# EasyEDA Pro project ProPrj_nigeria__2025-12-29.epro, board PCB1
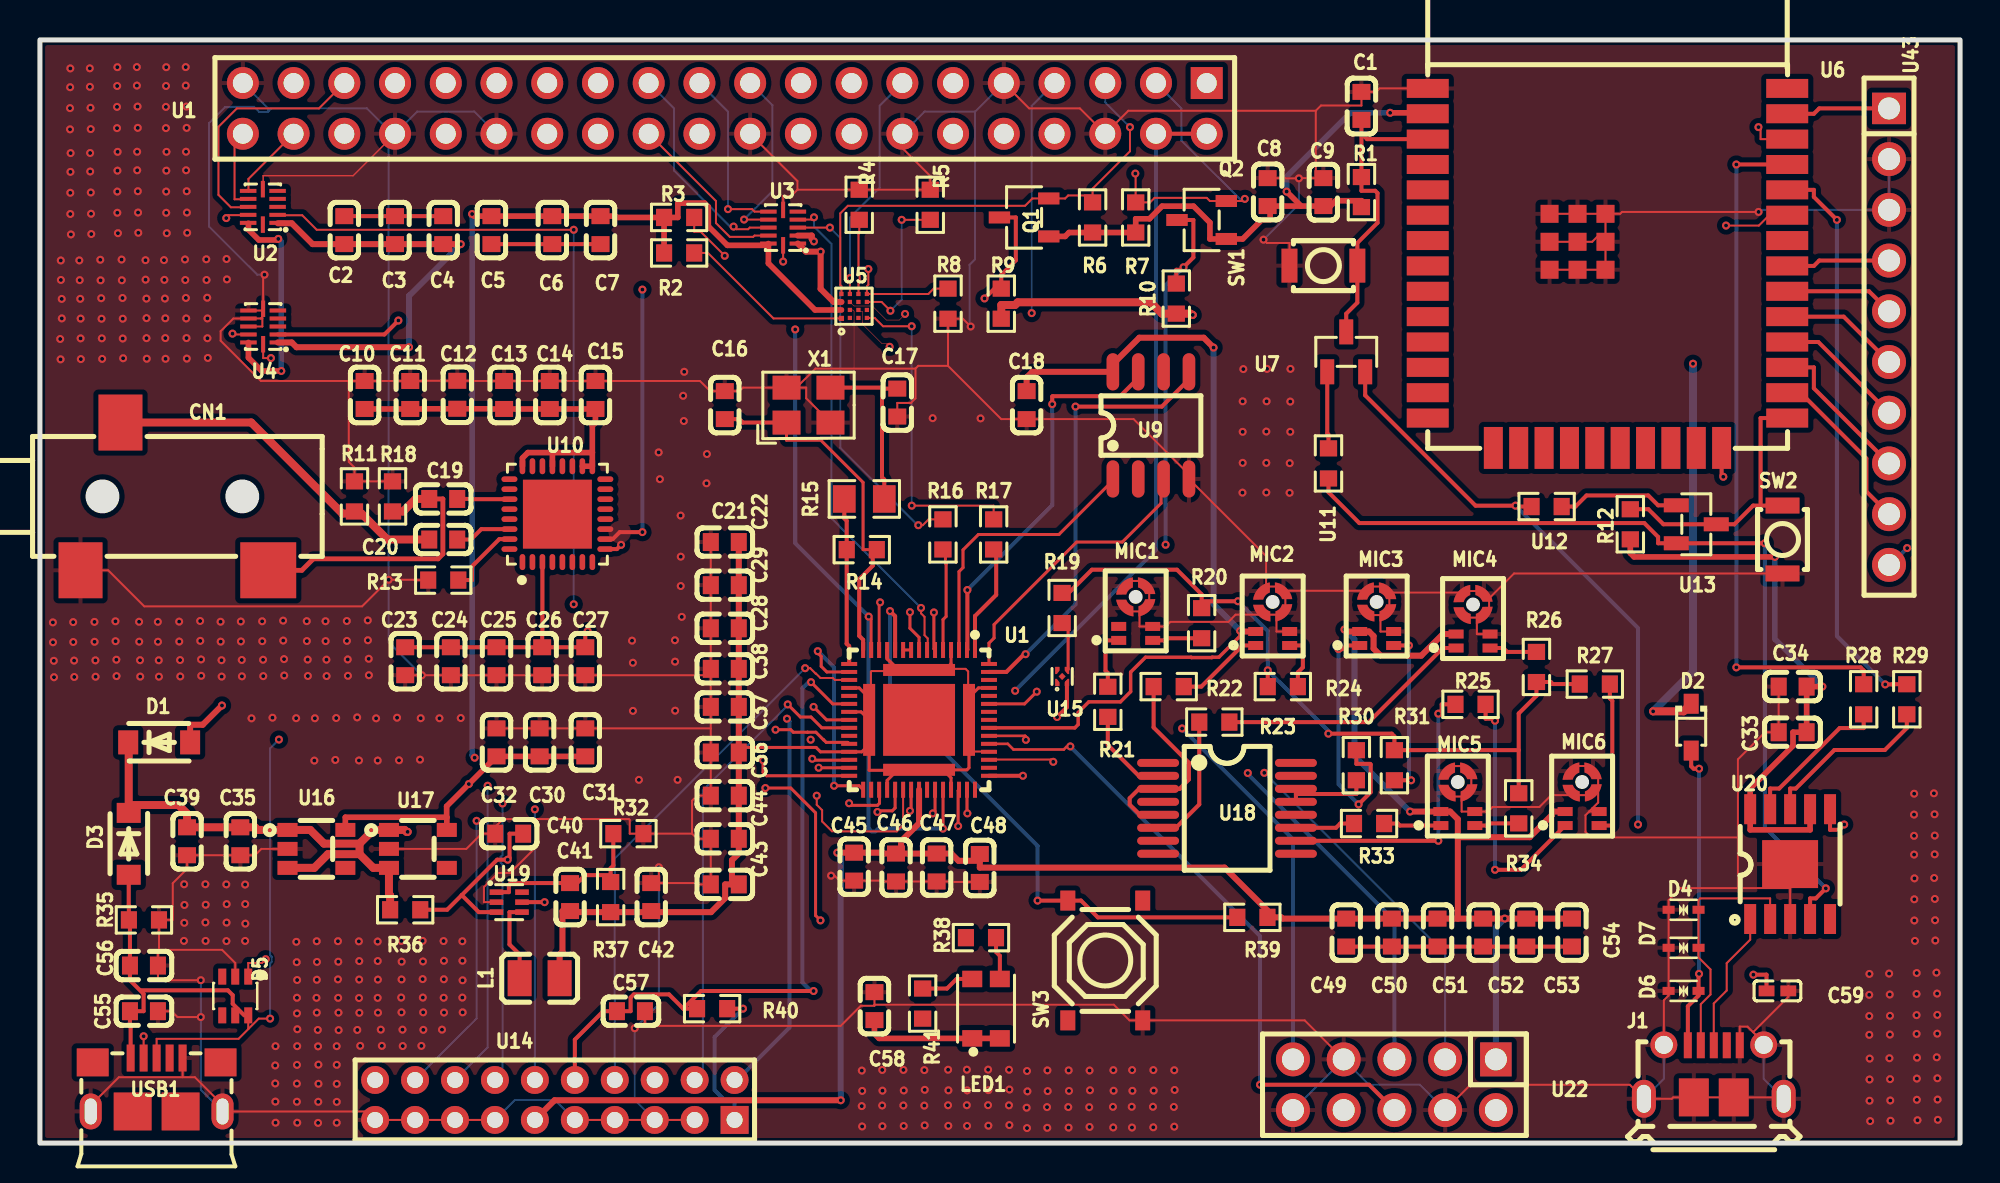
[diagram p7: board, top side]
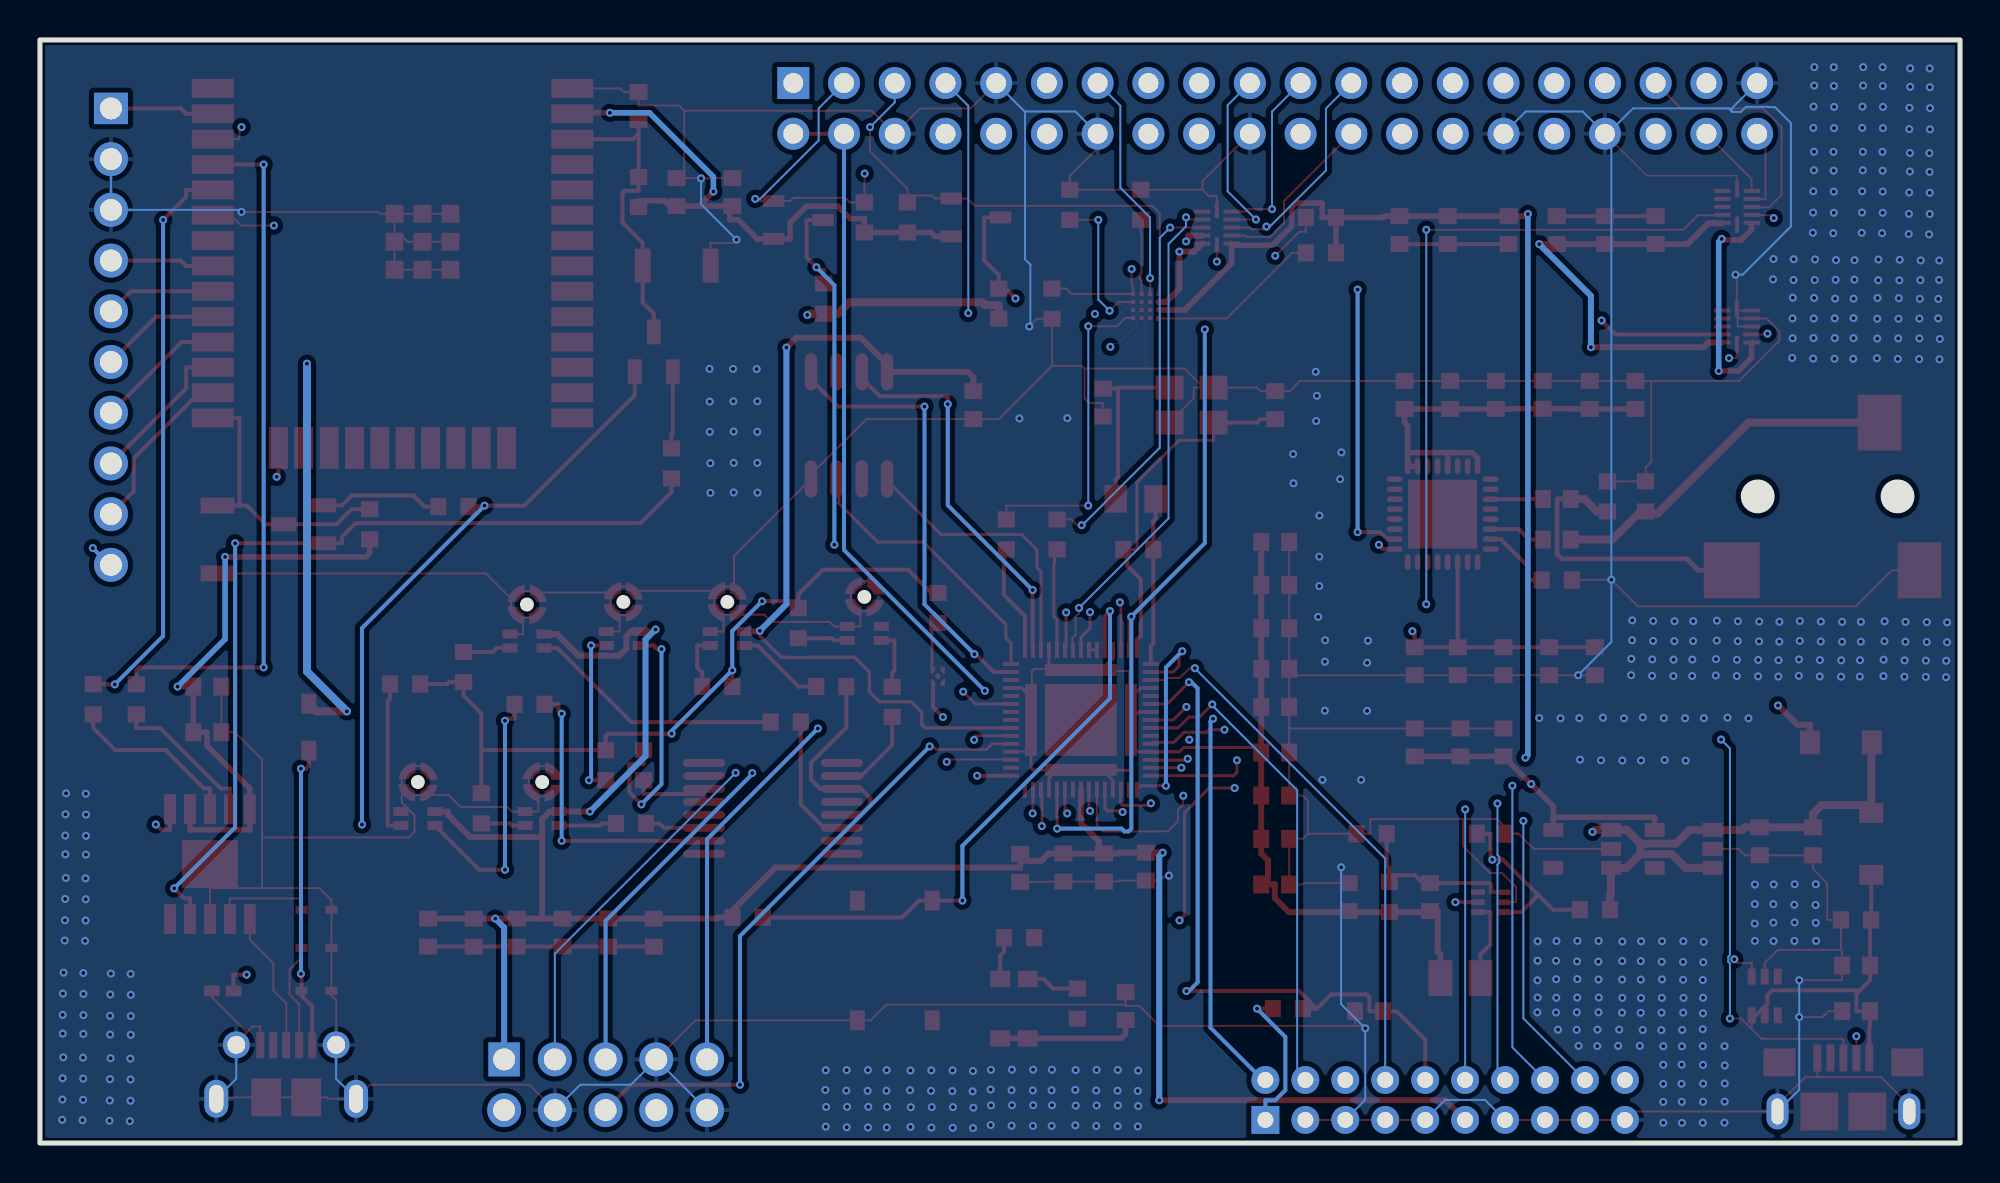
[diagram p8: board, bottom side, seen from below]

Outline 96.14 x 55.24 mm; copper layers: Top Layer, Inner1, Inner2, Bottom Layer. Coordinates in mm from the lower left corner of the outline.
Outline path: rectangle 0,55.24 96.14,0
Stack: Top Layer 0.035mm Outer layer thickness 1oz / Dielectric1 0.2104mm 7628 RC49% 8.6mil / Inner1 0.0152mm Inner layer thickness / Dielectric2 1.065mm 1.1mm H/HOZ Copper / Inner2 0.0152mm Inner layer thickness / Dielectric3 0.2104mm 7628 RC49% 8.6mil / Bottom Layer 0.035mm Outer layer thickness 1oz

## Design rules (mm)
net DN: DP1
net DP: DP1
net D-: DP2
net D+: DP2
template: User Custom Config
spacing safeClearance1 (default): track to track 0, other pairs 0 to 0.3
spacing all_voltages: track to track 0, other pairs 0 to 0.3
spacing safeClearance2: track to track 0, other pairs 0 to 0.3
spacing small_component: track to track 0, other pairs 0 to 0.3
spacing gnd: track to track 0, other pairs 0 to 0.3
spacing dp dn: track to track 0, other pairs 0 to 0.3
track width copperThickness1oz (default): min 0.003, default 0.01, max 0.1
track width 5v: min 0.3, default 0.4, max 1.2
track width gnd: min 0.1, default 0.1, max 0.1
track width 3v3: min 0.127, default 0.28, max 2.54
track width usb_VBUS: min 0.4, default 0.4, max 2.54
track width dp: min 0.1, default 0.1, max 2.54
track width dn: min 0.1, default 0.1, max 2.54
track width p1_5v: min 0.3, default 0.4, max 2.54
track width 6n1037: min 0.1, default 0.1, max 2.54
track width 6n1650: min 0.1, default 0.1, max 2.54
track width 6n1189: min 0.1, default 0.1, max 2.54
track width VDD: min 0.3, default 0.3, max 2.54
track width RRST_N: min 0.1, default 0.1, max 2.54
track width 1V8: min 0.127, default 0.2, max 2.54
track width RESET_N: min 0.1, default 0.1, max 2.54
track width 5n730: min 0.2, default 0.2, max 2.54
track width 5n774: min 0.3, default 0.4, max 2.54
track width 5n913: min 0.4, default 0.4, max 2.54
track width 5n869: min 0.4, default 0.4, max 2.54
track width 2n3128: min 0.1, default 0.1, max 2.54
track width 2n3196: min 0.1, default 0.1, max 2.54
track width small_component: min 0.1, default 0.1, max 2.54
differential pair dp_dn (default): width min 0.155, default 0.155, max 0.155; gap min 0.203, default 0.203
differential pair dp-dn: width min 0.155, default 0.155, max 0.155; gap min 0.203, default 0.203
via small_component (default): diameter min 0.3, default 0.4, max 10; hole min 0.1, default 0.2, max 6.3
net +3.3V uses 3v3, all_voltages
net GND uses gnd
net 3V3 uses 3v3, all_voltages
net 1V8 uses small_component
net VDD uses small_component
net $5N730 uses small_component
net $5N774 uses 5v, all_voltages
net $2N3128 uses small_component
net VDDIO uses small_component
net RST_N uses small_component
net VDDIO0 uses small_component
net $5N869 uses small_component
net $5N913 uses 5v, all_voltages
net 3V3A uses 3v3, all_voltages
net 5V uses 5v, all_voltages
net DN uses dn, dp dn, dp-dn
net DP uses dp, dp dn, dp-dn
net USB_VBUS uses all_voltages
net +3V3 uses 3v3, all_voltages
net PI_I2C_SCL uses small_component
net PI_I2C_SDA uses small_component
net BUTA uses small_component
net $2N3476 uses small_component
net BOOT_SEL uses small_component
net $2N3565 uses small_component
net SPI_CLK uses small_component
net $4N2409 uses small_component
net PI_INT_N uses small_component
net SPI_OE uses small_component
net MCLK_OE uses small_component
net I2S_OE uses small_component
net QSPI_D2 uses small_component
net INT_N uses small_component
net MIC_DATA2 uses small_component
net DAC_RST uses small_component
net MIC_CLK uses small_component
net MCLK uses small_component
net X1UP1 uses small_component
net X1UP0 uses small_component
net X1DN0 uses small_component
net X1DN1 uses small_component
net X1D13 uses small_component
net TCK uses small_component
net TD0 uses small_component
net TDI uses small_component
net I2S_BCLK uses small_component
net I2S_DATA0 uses small_component
net SPI_MOSI uses small_component
net QSPI_CS_N uses small_component
net QSPI_D3 uses small_component
net QSPI_CLK uses small_component
net PI_SPI_MISO uses small_component
net PI_SPI_MOSI uses small_component
net PI_SPI_CLK uses small_component
net PI_SPI_CS_N uses small_component
net PI_MCLK uses small_component
net PI_I2S_DIN uses small_component
net PI_I2S_DOUT uses small_component
net PI_I2S_LRCK uses small_component
net PI_I2S_BCLK uses small_component
net XVF_RST_N uses small_component
net DAC_RST_N uses small_component
net TDO uses small_component
net D- uses dn, dp dn, dp-dn
net D+ uses dp, dp dn, dp-dn
diff pair DP1 uses dp-dn
diff pair DP2 uses dp-dn
['net', 'd-'] ['NET', 'D+'] uses dp dn
['net', 'dp'] ['NET', 'DN'] uses dp dn
['net', '1v8'] ['NET', '3V3'] uses default
['net', '1v8'] ['NET', '3V3'] uses default

## Placement (name value [footprint] x y rotation side)
C1  1uF  [C0603]  66.17 51.94 90 top
C2  100nF  [C0603]  15.24 45.72 270 top
C3  100nF  [C0603]  17.78 45.72 270 top
C4  100nF  [C0603]  20.19 45.72 270 top
C5  100nF  [C0603]  22.61 45.72 90 top
C6  100nF  [C0603]  25.65 45.72 90 top
C7  100nF  [C0603]  28.07 45.72 90 top
C8  100nF  [C0603]  61.47 47.62 270 top
C9  100nF  [C0603]  64.26 47.62 90 top
C10  100nF  [C0603]  16.26 37.46 90 top
C11  100nF  [C0603]  18.54 37.46 270 top
C12  100nF  [C0603]  20.9 37.47 270 top
C13  100nF  [C0603]  23.24 37.46 90 top
C14  100nF  [C0603]  25.53 37.46 90 top
C15  100nF  [C0603]  27.81 37.46 270 top
C16  100nF  [C0603]  34.29 36.96 270 top
C17  100nF  [C0603]  42.93 37.08 90 top
C18  1uF  [C0603]  49.4 36.96 270 top
C19  18pF  [C0603]  20.19 32.26 0 top
C20  18pF  [C0603]  20.19 30.23 0 top
C21  100nF  [C0603]  34.29 30.1 0 top
C22  100nF  [C0603]  34.29 27.94 0 top
C23  100nF  [C0603]  18.29 24.13 270 top
C24  100nF  [C0603]  20.57 24.13 90 top
C25  100nF  [C0603]  22.86 24.13 90 top
C26  10nF  [C0603]  25.15 24.13 90 top
C27  100nF  [C0603]  27.3 24.13 90 top
C28  100nF  [C0603]  34.29 23.75 0 top
C29  100nF  [C0603]  34.29 25.78 0 top
C30  100nF  [C0603]  25.02 20.07 270 top
C31  100nF  [C0603]  27.3 20.07 270 top
C32  100nF  [C0603]  22.86 20.07 270 top
C33  100nF  [C0603]  87.76 20.57 0 top
C34  100nF  [C0603]  87.76 22.86 0 top
C35  100nF  [C0603]  10.03 15.11 90 top
C36  100nF  [C0603]  34.29 17.4 0 top
C37  100nF  [C0603]  34.29 19.56 0 top
C38  4.7uF  [C0603]  34.29 21.84 0 top
C39  4.7uF  [C0603]  7.37 15.11 90 top
C40  4.7uF  [C0603]  23.5 15.49 0 top
C41  4.7uF  [C0603]  26.54 12.32 270 top
C42  1uF  [C0603]  30.61 12.32 270 top
C43  1uF  [C0603]  34.29 12.95 0 top
C44  470pF  [C0603]  34.29 15.24 0 top
C45  22uF  [C0603]  40.77 13.84 90 top
C46  100nF  [C0603]  42.86 13.8 90 top
C47  100nF  [C0603]  44.9 13.8 90 top
C48  100nF  [C0603]  47.06 13.78 90 top
C49  100nF  [C0603]  65.41 10.54 90 top
C50  100nF  [C0603]  67.69 10.54 90 top
C51  100nF  [C0603]  69.98 10.54 90 top
C52  100nF  [C0603]  72.26 10.54 90 top
C53  100nF  [C0603]  74.42 10.54 90 top
C54  100nF  [C0603]  76.71 10.54 90 top
C55  100nF  [C0603]  5.21 6.6 180 top
C56  100nF  [C0603]  5.21 8.89 180 top
C57  10nF  [C0603]  29.59 6.6 180 top
C58  1uF  [C0603]  41.78 6.86 270 top
C59  100nF  [C0402_NEW]  86.99 7.62 180 top
CN1  SJ-3523-SMT-TR  [AUDIO-SMD_SJ-3523-SMT-TR]  6.73 32.38 0 top
D1  PMEG2010AEH,115  [SOD-123F_L2.8-W1.8-LS3.7-RD]  5.97 20.07 0 top
D2  NUP4114UCLW1T2G  [SOD-323_L1.8-W1.3-LS2.5-RD]  82.68 20.83 270 top
D3  PMEG2010AEH,115  [SOD-123F_L2.8-W1.8-LS3.7-RD]  4.45 14.99 270 top
D4  PMEG2010AEH,115  [SOD-523_L1.2-W0.8-LS1.6-BI]  82.3 11.68 0 top
D5  LESD5D5.0CT1G  [SOT-363-6_L2.0-W1.3-P0.65-LS2.3-BL]  9.78 7.37 180 top
D6  BAT760-7  [SOD-523_L1.2-W0.8-LS1.6-BI]  82.3 7.62 0 top
D7  LESD5D5.0CT1G  [SOD-523_L1.2-W0.8-LS1.6-BI]  82.3 9.78 0 top
J1  105017-0001  [MICRO-USB-SMD_105017-0001]  83.81 3.57 0 top
L1  1.5uH  [L0806]  25.02 8.25 0 top
LED1  LTST-C155KGJRKT  [LED-ARRAY-SMD_4P-L3.2-W2.7-BR]  47.37 6.73 270 top
MIC1  IM69D130V01  [MIC-SMD_5P-L4.0-W3.0-P0.70-TR_IM69D130V01]  54.86 26.54 180 top
MIC2  IM69D130V01  [MIC-SMD_5P-L4.0-W3.0-P0.70-TR_IM69D130V01]  61.72 26.29 180 top
MIC3  IM69D130V01  [MIC-SMD_5P-L4.0-W3.0-P0.70-TR_IM69D130V01]  66.93 26.29 180 top
MIC4  IM69D130V01  [MIC-SMD_5P-L4.0-W3.0-P0.70-TR_IM69D130V01]  71.76 26.16 180 top
MIC5  IM69D130V01  [MIC-SMD_5P-L4.0-W3.0-P0.70-TR_IM69D130V01]  70.99 17.27 180 top
MIC6  IM69D130V01  [MIC-SMD_5P-L4.0-W3.0-P0.70-TR_IM69D130V01]  77.22 17.27 180 top
Q1  BSS138  [SOT-23-3_L2.9-W1.6-P1.90-LS2.8-BR]  49.28 46.35 0 top
Q2  BSS138  [SOT-23-3_L2.9-W1.6-P1.90-LS2.8-BR]  58.17 46.23 0 top
R1  470Ω  [R0603]  66.17 47.62 270 top
R2  1kΩ  [R0603]  32 44.58 180 top
R3  10kΩ  [R0603]  32 46.35 180 top
R4  10kΩ  [R0603]  41.02 46.99 90 top
R5  100Ω  [R0603]  44.58 46.99 90 top
R6  100Ω  [R0603]  52.7 46.35 270 top
R7  100Ω  [R0603]  54.86 46.35 270 top
R8  100Ω  [R0603]  45.47 42.04 270 top
R9  100Ω  [R0603]  48.13 42.04 270 top
R10  100Ω  [R0603]  56.9 42.29 270 top
R11  100Ω  [R0603]  15.75 32.38 270 top
R12  100Ω  [R0603]  79.63 30.99 270 top
R13  100Ω  [R0603]  20.19 28.19 0 top
R14  100Ω  [R0603]  41.15 29.72 0 top
R15  100Ω  [R0805]  41.27 32.26 180 top
R16  100Ω  [R0603]  45.21 30.48 270 top
R17  4.7kΩ  [R0603]  47.75 30.48 270 top
R18  10kΩ  [R0603]  17.65 32.38 270 top
R19  100Ω  [R0603]  51.18 26.8 90 top
R20  100Ω  [R0603]  58.17 26.03 270 top
R21  100Ω  [R0603]  53.47 22.1 270 top
R22  100Ω  [R0603]  56.52 22.86 180 top
R23  100Ω  [R0603]  58.8 21.08 180 top
R24  100Ω  [R0603]  62.23 22.86 0 top
R25  100Ω  [R0603]  71.63 21.97 180 top
R26  100Ω  [R0603]  74.93 23.84 90 top
R27  0Ω  [R0603]  77.85 22.99 0 top
R28  0Ω  [R0603]  91.31 22.22 90 top
R29  10kΩ  [R0603]  93.47 22.22 90 top
R30  100Ω  [R0603]  65.91 18.92 270 top
R31  100Ω  [R0603]  67.82 18.92 270 top
R32  10kΩ  [R0603]  29.46 15.49 180 top
R33  100Ω  [R0603]  66.55 16 180 top
R34  47kΩ  [R0603]  74.04 16.76 270 top
R35  47kΩ  [R0603]  5.21 11.18 180 top
R36  47kΩ  [R0603]  18.29 11.68 0 top
R37  47kΩ  [R0603]  28.58 12.32 270 top
R38  1MΩ  [R0603]  47.12 10.29 0 top
R39  680Ω  [R0603]  60.71 11.3 0 top
R40  4.7kΩ  [R0603]  33.66 6.73 0 top
R41  330Ω  [R0603]  44.2 6.98 90 top
SW1  TS-1187A-B-A-B  [KEY-SMD_B3U-1000PM]  64.26 43.94 0 top
SW2  B3U-1000P  [KEY-SMD_B3U-1000PM]  87.25 30.23 90 top
SW3  TS-1187A-B-A-B  [SW-SMD_4P-L5.1-W5.1-P3.70-LS6.5-TL_H1.5]  53.34 9.14 90 top
U1  XU316-1024-QF60B-C24  [QFN-60_L7.0-W7.0-P0.40-TL-EP_XU316-1024]  44.02 21.19 270 top
U1#2  -  [HDR-TH_40P-P2.54-V-F-R2-C20-S2.54]  34.29 51.82 180 top
U2  74LVC1G125GX125  [UQFN-12_L2.0-W1.7-P0.40-BL]  11.16 46.88 90 top
U3  SN74LVC257ADBR  [UQFN-12_L2.0-W1.7-P0.40-BL]  37.21 45.85 90 top
U4  W25Q32JVSNIQ  [UQFN-12_L2.0-W1.7-P0.40-BL]  11.18 40.89 90 top
U5  TXB0104RUTR  [X2QFN-16_L1.6-W1.6-R4-C4-P0.4-TL]  40.77 41.91 90 top
U6  TXB0104RUTR  [WIFI-SMD_ESP32-WROOM-32E]  78.49 43.81 270 top
U7  TXB0104RUTR  [SOT-23-3_L2.9-W1.3-P1.90-LS2.4-BR]  65.41 39.62 270 top
U9  TLV320DAC3101IRHBR  [SOP-8_L4.9-W3.9-P1.27-LS6.0-BL]  55.63 35.94 0 top
U10  NCP114ASN180T1G  [VQFN-32_L5.0-W5.0-P0.50-TL-EP3.5]  25.91 31.5 90 top
U11  10kΩ  [R0603]  64.52 34.04 90 top
U12  10kΩ  [R0603]  75.44 31.88 0 top
U13  10kΩ  [SOT-23-3_L2.9-W1.3-P1.90-LS2.4-BR]  82.93 30.99 180 top
U14  FH2.0-09-10PZS  [HDR-TH_20P-P2.00-V-F-R2-C10-S2.00-3]  25.78 2.16 180 top
U15  PM254-2-20-Z-8.5  [X2SON-5_L0.8-W0.8-P0.48-BL-EP]  51.18 23.37 90 top
U16  AP61102Z6-7  [TSOP-5_L3.0-W1.5-P0.95-LS2.8-BR]  13.84 14.73 180 top
U17  NCP114ASN180T1G  [TSOP-5_L3.0-W1.5-P0.95-LS2.8-BR]  18.92 14.73 180 top
U18  SN74LVC257ADBR  [SSOP-16_L6.2-W5.3-P0.65-LS7.8-BL]  59.44 16.76 270 top
U19  AP61102Z6-7  [SOT-563-6_L1.6-W1.2-P0.50-LS1.6-BL]  23.5 12.06 270 top
U20  CH340K  [ESOP-10_L4.9-W3.9-P1.00-LS6.2-BL-EP]  87.63 13.97 0 top
U22  S8050-MS  [HDR-TH_10P-P2.54-V-F-R2-C5-S2.54]  67.82 2.92 180 top
U43  PM254-1-10-Z-8.5  [HDR-TH_10P-P2.54-V-F]  92.58 40.39 270 top
USB1  10118193-0001LF  [MICRO-USB-SMD_10118193-0001LF]  5.84 2.92 0 top
X1  24MHz  [CRYSTAL-SMD_4P-L3.2-W2.5-BL-1]  38.48 36.96 0 top

## Footprints (pads in the part's own frame, mm; a bottom-side part is the same pattern mirrored in y, then rotated)
AUDIO-SMD_SJ-3523-SMT-TR
  rect 2.2x2.8 smd: 1(-4.7,-3.7) 3(-2.7,3.7)
  rect 2.8x2.8 smd: 2(4.7,-3.7)
C0402_NEW
  rect 0.79x0.54 smd: 1(-0.545,0) 2(0.545,0)
C0603
  rect 0.8x0.9 smd: 1(-0.7,0) 2(0.7,0)
CRYSTAL-SMD_4P-L3.2-W2.5-BL-1
  rect 1.4x1.2 smd: 1(-1.1,-0.875) 2(1.1,-0.875) 3(1.1,0.875) 4(-1.1,0.875)
ESOP-10_L4.9-W3.9-P1.00-LS6.2-BL-EP
  rect 0.6x1.5 smd: 1(-2,-2.75) 2(-1,-2.75) 3(0,-2.75) 4(1,-2.75) 5(2,-2.75) 6(2,2.75) 7(1,2.75) 8(0,2.75) 9(-1,2.75) 10(-2,2.75)
  rect 2.8x2.4 smd: 11(0,0)
HDR-TH_10P-P2.54-V-F
  rect 1.575x1.7 hole 1.1: 1(-11.43,0)
  round 1.7 hole 1.1: 2(-8.89,0) 3(-6.35,0) 4(-3.81,0) 5(-1.27,0) 6(1.27,0) 7(3.81,0) 8(6.35,0) 9(8.89,0) 10(11.43,0)
HDR-TH_10P-P2.54-V-F-R2-C5-S2.54
  rect 1.575x1.7 hole 1.1: 1(-5.08,-1.27)
  round 1.7 hole 1.1: 2(-5.08,1.27) 3(-2.54,-1.27) 4(-2.54,1.27) 5(0,-1.27) 6(0,1.27) 7(2.54,-1.27) 8(2.54,1.27) 9(5.08,-1.27) 10(5.08,1.27)
HDR-TH_20P-P2.00-V-F-R2-C10-S2.00-3
  rect 1.4x1.4 hole 0.8: 1(-9,1)
  round 1.4 hole 0.8: 2(-9,-1) 3(-7,1) 4(-7,-1) 5(-5,1) 6(-5,-1) 7(-3,1) 8(-3,-1) 9(-1,1) 10(-1,-1) 11(1,1) 12(1,-1) 13(3,1) 14(3,-1) 15(5,1) 16(5,-1) 17(7,1) 18(7,-1) 19(9,1) 20(9,-1)
HDR-TH_40P-P2.54-V-F-R2-C20-S2.54
  rect 1.6x1.6 hole 1: 1(-24.13,-1.27)
  round 1.6 hole 1: 2(-24.13,1.27) 3(-21.59,-1.27) 4(-21.59,1.27) 5(-19.05,-1.27) 6(-19.05,1.27) 7(-16.51,-1.27) 8(-16.51,1.27) 9(-13.97,-1.27) 10(-13.97,1.27) 11(-11.43,-1.27) 12(-11.43,1.27) 13(-8.89,-1.27) 14(-8.89,1.27) 15(-6.35,-1.27) 16(-6.35,1.27) 17(-3.81,-1.27) 18(-3.81,1.27) 19(-1.27,-1.27) 20(-1.27,1.27) 21(1.27,-1.27) 22(1.27,1.27) 23(3.81,-1.27) 24(3.81,1.27) 25(6.35,-1.27) 26(6.35,1.27) 27(8.89,-1.27) 28(8.89,1.27) 29(11.43,-1.27) 30(11.43,1.27) 31(13.97,-1.27) 32(13.97,1.27) 33(16.51,-1.27) 34(16.51,1.27) 35(19.05,-1.27) 36(19.05,1.27) 37(21.59,-1.27) 38(21.59,1.27) 39(24.13,-1.27) 40(24.13,1.27)
KEY-SMD_B3U-1000PM
  rect 0.8x1.7 smd: 1(-1.7,0) 2(1.7,0)
L0806
  rect 1.2x1.8 smd: 1(-1,0) 2(1,0)
LED-ARRAY-SMD_4P-L3.2-W2.7-BR
  rect 0.825x1 smd: 1(1.488,-0.69) 2(1.488,0.69) 3(-1.488,-0.69) 4(-1.488,0.69)
MIC-SMD_5P-L4.0-W3.0-P0.70-TR_IM69D130V01
  rect 0.75x0.45 smd: 1(0.85,1.37) 2(0.85,0.67) 3(-0.85,1.37) 4(-0.85,0.67)
  custom 0.84x0.87 smd: 5(-0.56,-0.265) 5(0.56,-1.355)
  custom 0.87x0.84 smd: 5(-0.545,-1.37) 5(0.545,-0.25)
MICRO-USB-SMD_105017-0001
  rect 0.4x1.3 smd: 1(-1.3,1.33) 2(-0.65,1.33) 3(0,1.33) 4(0.65,1.33) 5(1.3,1.33)
  round 1.35 hole 0.9: 6(-2.5,1.35) 7(2.5,1.35)
  oval 1.2x1.9 hole 0.7x1.4: 8(3.5,-1.35) 9(-3.5,-1.35)
  rect 1.5x1.9 smd: 10(-1,-1.28) 10(1,-1.28)
MICRO-USB-SMD_10118193-0001LF
  rect 0.4x1.35 smd: 1(-1.3,1.338) 2(-0.65,1.338) 3(0,1.338) 4(0.65,1.338) 5(1.3,1.338)
  oval 1.1x1.8 hole 0.6x1.3: 6(-3.3,-1.337) 6(3.3,-1.338)
  rect 1.6x1.4 smd: 7(-3.2,1.119) 8(3.2,1.119)
  rect 1.9x1.9 smd: 7(-1.2,-1.337) 8(1.2,-1.337)
QFN-60_L7.0-W7.0-P0.40-TL-EP_XU316-1024
  rect 0.8x0.2 smd: 1(-3.5,2.8) 2(-3.5,2.4) 3(-3.5,2) 4(-3.5,1.601) 5(-3.5,1.2) 6(-3.5,0.8) 7(-3.5,0.4) 8(-3.5,0) 9(-3.5,-0.4) 10(-3.5,-0.799) 11(-3.5,-1.2) 12(-3.5,-1.6) 13(-3.5,-2) 14(-3.5,-2.4) 15(-3.5,-2.8) 31(3.5,-2.8) 32(3.5,-2.4) 33(3.5,-2) 34(3.5,-1.6) 35(3.5,-1.2) 36(3.5,-0.799) 37(3.5,-0.4) 38(3.5,0) 39(3.5,0.4) 40(3.5,0.8) 41(3.5,1.2) 42(3.5,1.601) 43(3.5,2) 44(3.5,2.4) 45(3.5,2.8)
  rect 0.2x0.8 smd: 16(-2.8,-3.5) 17(-2.4,-3.5) 18(-2,-3.5) 19(-1.6,-3.5) 20(-1.2,-3.5) 21(-0.799,-3.5) 22(-0.4,-3.5) 23(0,-3.5) 24(0.4,-3.5) 25(0.8,-3.5) 26(1.2,-3.5) 27(1.6,-3.5) 28(2,-3.5) 29(2.4,-3.5) 30(2.8,-3.5) 46(2.8,3.5) 47(2.4,3.5) 48(2,3.5) 49(1.6,3.5) 50(1.2,3.5) 51(0.8,3.5) 52(0.4,3.5) 53(0,3.5) 54(-0.4,3.5) 55(-0.799,3.5) 56(-1.2,3.5) 57(-1.6,3.5) 58(-2,3.5) 59(-2.4,3.5) 60(-2.8,3.5)
  rect 0.6x3.6 smd: 61(-2.5,0) 63(2.5,0)
  rect 3.6x0.6 smd: 62(0,-2.5) 64(0,2.5)
  rect 3.6x3.6 smd: 65(0,0)
R0603
  rect 0.806x0.864 smd: 1(-0.753,0) 2(0.753,0)
R0805
  rect 1.133x1.377 smd: 1(-1,0) 2(1,0)
SOD-123F_L2.8-W1.8-LS3.7-RD
  rect 1x1.2 smd: 1(-1.55,0) 2(1.55,0)
SOD-323_L1.8-W1.3-LS2.5-RD
  rect 1x0.75 smd: 1(-1.173,0) 2(1.173,0)
SOD-523_L1.2-W0.8-LS1.6-BI
  rect 0.6x0.4 smd: 1(-0.75,0) 2(0.75,0)
SOP-8_L4.9-W3.9-P1.27-LS6.0-BL
  oval 0.63x1.865 smd: 1(-1.905,-2.683) 2(-0.635,-2.683) 3(0.635,-2.683) 4(1.905,-2.683) 5(1.905,2.683) 6(0.635,2.683) 7(-0.635,2.683) 8(-1.905,2.683)
SOT-23-3_L2.9-W1.3-P1.90-LS2.4-BR
  rect 1.25x0.7 smd: 1(1,-0.95) 2(1,0.95) 3(-1,0)
SOT-23-3_L2.9-W1.6-P1.90-LS2.8-BR
  rect 1.07x0.6 smd: 1(1.235,-0.95) 2(1.235,0.95) 3(-1.235,0)
SOT-363-6_L2.0-W1.3-P0.65-LS2.3-BL
  rect 0.4x0.8 smd: 1(-0.65,-0.97) 2(0,-0.97) 3(0.65,-0.97) 4(0.65,0.97) 5(0,0.97) 6(-0.65,0.97)
SOT-563-6_L1.6-W1.2-P0.50-LS1.6-BL
  rect 0.28x0.68 smd: 1(-0.5,-0.64) 2(0,-0.64) 3(0.5,-0.64) 4(0.5,0.64) 5(0,0.64) 6(-0.5,0.64)
SSOP-16_L6.2-W5.3-P0.65-LS7.8-BL
  oval 0.4x2.1 smd: 1(-2.275,-3.45) 2(-1.625,-3.45) 3(-0.975,-3.45) 4(-0.325,-3.45) 5(0.325,-3.45) 6(0.975,-3.45) 7(1.625,-3.45) 8(2.275,-3.45) 9(2.275,3.45) 10(1.625,3.45) 11(0.975,3.45) 12(0.325,3.45) 13(-0.325,3.45) 14(-0.975,3.45) 15(-1.625,3.45) 16(-2.275,3.45)
SW-SMD_4P-L5.1-W5.1-P3.70-LS6.5-TL_H1.5
  rect 1x0.75 smd: 1(-3,1.875) 2(3,1.875) 3(-3,-1.875) 4(3,-1.875)
TSOP-5_L3.0-W1.5-P0.95-LS2.8-BR
  rect 1x0.7 smd: 1(1.448,-0.95) 2(1.448,0) 3(1.448,0.95) 4(-1.448,0.95) 5(-1.448,-0.95)
UQFN-12_L2.0-W1.7-P0.40-BL
  rect 0.2x0.825 smd: 1(-0.8,-0.738) 2(-0.4,-0.738) 3(0,-0.738) 4(0.4,-0.738) 5(0.8,-0.738) 7(0.8,0.738) 8(0.4,0.738) 9(0,0.738) 10(-0.4,0.738) 11(-0.8,0.738)
  rect 0.825x0.2 smd: 6(0.887,0) 12(-0.887,0)
VQFN-32_L5.0-W5.0-P0.50-TL-EP3.5
  oval 0.8x0.28 smd: 1(-2.4,1.75) 2(-2.4,1.25) 3(-2.4,0.75) 4(-2.4,0.25) 5(-2.4,-0.25) 6(-2.4,-0.75) 7(-2.4,-1.25) 8(-2.4,-1.75) 17(2.4,-1.75) 18(2.4,-1.25) 19(2.4,-0.75) 20(2.4,-0.25) 21(2.4,0.25) 22(2.4,0.75) 23(2.4,1.25) 24(2.4,1.75)
  oval 0.28x0.8 smd: 9(-1.75,-2.4) 10(-1.25,-2.4) 11(-0.75,-2.4) 12(-0.25,-2.4) 13(0.25,-2.4) 14(0.75,-2.4) 15(1.25,-2.4) 16(1.75,-2.4) 25(1.75,2.4) 26(1.25,2.4) 27(0.75,2.4) 28(0.25,2.4) 29(-0.25,2.4) 30(-0.75,2.4) 31(-1.25,2.4) 32(-1.75,2.4)
  rect 3.45x3.45 smd: 33(-0.001,0)
WIFI-SMD_ESP32-WROOM-32E
  rect 0.95x2.1 smd: 1(-9.002,-9) 2(-7.732,-9) 3(-6.463,-9) 4(-5.192,-9) 5(-3.922,-9) 6(-2.652,-9) 7(-1.383,-9) 8(-0.113,-9) 9(1.157,-9) 10(2.428,-9) 11(3.697,-9) 12(4.968,-9) 13(6.237,-9) 14(7.508,-9) 25(7.508,9) 26(6.237,9) 27(4.968,9) 28(3.697,9) 29(2.428,9) 30(1.157,9) 31(-0.113,9) 32(-1.383,9) 33(-2.652,9) 34(-3.922,9) 35(-5.192,9) 36(-6.463,9) 37(-7.732,9) 38(-9.002,9)
  rect 2.1x0.95 smd: 15(9.002,-5.715) 16(9.002,-4.445) 17(9.002,-3.175) 18(9.002,-1.905) 19(9.002,-0.635) 20(9.002,0.635) 21(9.002,1.905) 22(9.002,3.175) 23(9.002,4.445) 24(9.002,5.715)
  rect 0.9x0.9 smd: 39(-2.721,-0.1) 39(-2.721,-1.5) 39(-2.721,-2.9) 39(-1.321,-0.1) 39(-1.321,-1.5) 39(-1.321,-2.9) 39(0.079,-0.1) 39(0.079,-1.5) 39(0.079,-2.9)
X2QFN-16_L1.6-W1.6-R4-C4-P0.4-TL
  rect 0.26x0.26 smd: A1(-0.613,0.637)
  rect 0.21x0.21 smd: A2(-0.188,0.637) A3(0.212,0.637) A4(0.613,0.637) B1(-0.588,0.212) B2(-0.188,0.212) B3(0.212,0.212) B4(0.613,0.212) C1(-0.588,-0.212) C2(-0.188,-0.212) C3(0.212,-0.212) C4(0.613,-0.212) D1(-0.588,-0.637) D2(-0.188,-0.637) D3(0.212,-0.637) D4(0.613,-0.637)
X2SON-5_L0.8-W0.8-P0.48-BL-EP
  custom 0.36x0.22 smd: 1(-0.3,0.24) 2(-0.3,-0.24) 4(0.3,-0.24) 5(0.3,0.24)
  rect 0.25x0.25 smd rot 45: 3(0,0)

## Nets
1V8: C23.1 C24.2 C25.2 C26.2 C27.2 R40.2 U1.17 U1.26 U1.31 U10.3 U14.1
3V3: C5.2 C6.2 C7.2 C30.2 C31.2 C32.2 C33.2 C34.2 R2.2 R3.2 R12.2 U1.30 U2.11 U3.11 U4.11 U5.A2 U16.5 U17.5 U20.7 U20.10
3V3A: C10.1 C11.2 C12.2 C13.1 C14.1 C15.2 U10.17 U10.18 U10.21 U10.24
5V: C35.2 C39.2 D1.1 D2.1 D3.1 R9.2 R10.2 R36.1 U16.1 U16.3 U17.1 U17.3
+3.3V: C58.2 LED1.1 LED1.2
+3V3: C8.2 C9.1 Q1.1 Q2.1 R1.2 R6.2 R7.2 U6.2
GND: C1.2 C8.1 C9.2 C10.2 C11.1 C12.1 C13.2 C14.2 C15.1 C16.1 C17.1 C18.2 C21.1 C22.1 C23.2 C24.1 C25.1 C26.1 C27.1 C28.1 C29.1 C30.1 C31.1 C32.1 C33.1 C34.1 C35.1 C36.1 C37.1 C38.1 C39.1 C40.1 C42.1 C43.1 C44.1 C45.1 C46.1 C47.1 C48.1 C55.1 C56.1 C57.1 C58.1 C59.1 CN1.1 D4.1 D5.2 D6.1 D7.1 J1.5 J1.6 J1.7 J1.8 J1.9 J1.10 MIC1.4 MIC1.5 MIC2.4 MIC2.5 MIC3.4 MIC3.5 MIC4.4 MIC4.5 MIC5.4 MIC5.5 MIC6.4 MIC6.5 R4.2 R5.2 R8.2 R11.1 R13.1 R18.1 R32.1 R35.1 SW1.1 SW2.1 SW3.3 U1#2.6 U1#2.9 U1#2.14 U1#2.20 U1#2.30 U1#2.34 U1#2.39 U2.6 U3.6 U4.6 U4.7 U4.8 U4.9 U5.B2 U6.1 U6.39 U9.4 U14.3 U14.5 U14.7 U14.9 U14.13 U14.15 U14.17 U14.19 U16.2 U17.2 U19.2 U20.3 U20.11 U22.4 U22.7 U22.10 U43.2 U43.3 USB1.5 USB1.6 X1.2 X1.4
VDD: C21.2 C22.2 C28.2 C29.2 C36.2 C37.2 C38.2 C41.2 C42.2 C43.2 C44.2 L1.2 R37.2 U1.4 U1.12 U1.19 U1.22 U1.27 U1.34 U1.42 U1.49 U1.57 U1.61 U1.62 U1.63 U1.64
VDDIO: C18.1 C45.2 C46.2 C47.2 C48.2 C49.2 C50.2 C51.2 C52.2 C53.2 C54.2 MIC2.2 MIC3.2 MIC4.2 MIC5.2 MIC6.2 R39.2 U1.6 U1.8 U1.38 U1.52 U3.2 U9.8 U14.11 U22.1
VDDIO0: C2.2 C3.2 C4.2 U2.1 U3.1 U4.1 U5.A3
BCLK: U10.7
BOOT_SEL: R17.1 U5.D1
BUTA: R39.1 SW3.2 U1.11
D+: J1.3 U20.1
D-: D4.2 D7.2 J1.2 U20.2
DAC_RST: U1.40 U1.44
DAC_RST_N: U5.C1
DIN_PRI: U10.5
DIN_SEC: U10.32
DN: D5.6 U1.28 USB1.3
DP: D5.1 U1.29 USB1.2
DTR: U11.1 U13.2 U20.4
I2C_SCL: U1.47
I2C_SDA: U1.45
I2S_BCLK: U1.13 U2.2
I2S_DATA0: U1.9 U1.10
I2S_DATA1: U1.39
I2S_DATA2: U1.53
I2S_DIN: U2.5
I2S_DOUT: U2.4
I2S_LRCK: U2.3
I2S_OE: R4.1 U5.C4
INT_N: U1.55 U5.C2
IO0: R12.1 SW2.2 U6.25 U13.3
LED_G: U1.58
LED_R: U1.56
LEDG: R41.1
LEDR: R38.1
MCLK: U1.14 U1.41 U4.2
MCLK_OE: R5.1 U4.12 U5.D3
MIC0_DATA: R21.2 U18.2
MIC1_DATA: R22.2 U18.3 U18.5
MIC2_DATA: R33.2 U18.11
MIC3_DATA: R30.2 U18.13 U18.14
MIC4_DATA: R23.2 U18.6
MIC5_DATA: R25.2 U18.10
MIC_CLK: U1.43 U15.2 U22.3
MIC_DATA0: U1.46 U22.5
MIC_DATA1: U1.50 U22.6
MIC_DATA2: U1.48 U22.8
MIC_DATA3: U1.51 U22.9
MIC_OEN: U22.2
NET12: U18.4
NET15: U18.7
NET16: U18.8
NET17: U18.16
NET18: U18.15
NET21: U18.12
NET24: U18.9
PI_5V: D1.2 U1#2.2 U1#2.4
PI_I2C_SCL: Q1.2 R6.1 U1#2.5 U5.A4 U6.36
PI_I2C_SDA: Q2.2 R7.1 U1#2.3 U5.B3 U6.33
PI_I2S_BCLK: U1#2.12 U2.10
PI_I2S_DIN: U1#2.38 U2.7
PI_I2S_DOUT: U1#2.40 U2.8
PI_I2S_LRCK: U1#2.35 U2.9
PI_INT_N: R3.1 U1#2.13 U5.B4
PI_MCLK: U1#2.7 U4.10
PI_SPI_CLK: U1#2.23 U3.9
PI_SPI_CS_N: U1#2.24 U3.10
PI_SPI_MISO: U1#2.21 U3.7
PI_SPI_MOSI: U1#2.19 U3.8
QSPI_CLK: U9.6
QSPI_CS_N: U1.3 U9.1
QSPI_D0: U1.59 U9.5
QSPI_D1: U9.2
QSPI_D2: U1.60 U9.3
QSPI_D3: U1.2 U9.7
RESET: C1.1 R1.1 SW1.2 U6.3 U7.3
RESET_N: R13.2 U10.31
RST_N: C57.2 R40.1 U1.21 U14.10
RTS: U7.2 U12.1 U20.6
RX_ESP: R29.2 U6.34
SCL: Q1.3 R9.1 U10.10
SDA: Q2.3 R10.1 U10.9
SPI_CLK: R16.1 U3.3
SPI_MISO: U3.5
SPI_MOSI: U1.7 U3.4
SPI_OE: R8.1 U3.12 U5.D4
SQL_NLIN: U1.54
TCK: U1.24 U14.4
TD0: U1.20
TDI: U1.18 U14.8
TDO: U14.6
TMS: U1.23 U14.2
TX_ESP: R28.2 U6.35
USB_VBUS: C55.2 C56.2 D3.2 D5.5 R35.2 USB1.1
WCLK: U10.6
X1D13: U1.32
X1DN0: U1.35 U14.14
X1DN1: U1.33 U14.12
X1UP0: U1.36 U14.16
X1UP1: U1.37 U14.18
XVF_RST_N: U5.B1
$1N233: LED1.3 R41.2
$1N309: LED1.4 R38.2
$2N3128: C16.2 R14.2 U1.15 X1.1
$2N3134: R14.1 R15.2 U1.16
$2N3196: C17.2 R15.1 X1.3
$2N3476: R17.2 U1.1
$2N3565: R16.2 U1.5
$3N1011: MIC5.1 R33.1
$3N1986: MIC3.1 R30.1
$3N1993: MIC1.3 R20.2
$3N1995: MIC2.3 R24.2
$3N1997: MIC3.3 R31.2
$3N1999: MIC4.3 R26.2
$3N2001: MIC6.3 R27.2
$3N2003: MIC5.3 R34.2
$3N2005: R19.1 U15.4
$3N2007: R19.2 R20.1 R24.1 R26.1 R27.1 R31.1 R34.1
$3N2028: MIC2.1 R22.1
$3N2030: MIC4.1 R23.1
$3N2043: MIC6.1 R25.1
$3N2303: MIC1.1 R21.1
$3N4917: C49.1 C50.1 C51.1 C52.1 C53.1 C54.1
$4N1749: C5.1 C6.1 C7.1
$4N1787: C2.1 C3.1 C4.1
$4N2409: R2.1 U5.A1
$5N730: C20.2 U10.30
$5N774: C20.1 CN1.3 R11.2
$5N869: C19.2 U10.27
$5N913: C19.1 CN1.2 R18.2
$6N1037: C40.2 R36.2 U19.3 U19.5
$6N1189: L1.1 U19.4
$6N1650: C41.1 R32.2 R37.1 U19.1
$7N1239: C59.2 D2.2 D6.2 J1.1
$7N1255: R28.1 U20.9
$7N1256: R29.1 U20.8
$7N1266: U12.2 U13.1
$7N1267: U7.1 U11.2
$7N2699: U6.31 U43.4
$7N2708: U6.30 U43.5
$7N2715: U6.29 U43.6
$7N2759: U6.37 U43.1
$7N2776: U6.28 U43.7
$7N2785: U6.27 U43.8
$7N2792: U6.26 U43.9
$7N2799: U6.24 U43.10
$7N4055: U6.23

Pads without a net: D5 3 4; J1 4; MIC1 2; SW3 1 4; U1 25 65; U1#2 1 8 10 11 15 16 17 18 22 25 26 27 28 29 31 32 33 36 37; U2 12; U4 3 4 5; U5 C3 D2; U6 4 5 6 7 8 9 10 11 12 13 14 15 16 17 18 19 20 21 22 32 38; U10 1 2 4 8 11 12 13 14 15 16 19 20 22 23 25 26 28 29 33; U14 20; U15 1 3 5; U16 4; U17 4; U18 1; U19 6; U20 5; USB1 4 7 8

## Via types
v1: diameter 0.4, hole 0.2, Top Layer to Bottom Layer, 447 vias
v2: diameter 0.402, hole 0.198, Top Layer to Bottom Layer, 133 vias

## Routing (per net, layer and track width the routed paths; a pad name or vN(x,y) marks a point on that pad's centre or on a via; arc(x,y) is an arc through that point)
1V8: length 67.4
  Top Layer w0.15: 38.95,24.51 38.99,24.51 39.12,24.38 39.12,23.88 39.4,23.59 U1.17 ; U1.31 41.02,17.89 v2(39.76,17.89) ; v1(36.83,20.7) 37.59,20.7 37.72,20.57 38.43,20.57 38.43,20.58 38.85,20.58 39.23,20.19 39.24,20.19 39.37,20.07 40.45,20.07 40.52,19.99
  Top Layer w0.201: v2(27.42,25.63) 27.3,25.51 C27.2 C26.2 ; v2(35.2,6.73) 34.41,6.73 ; C26.2 C25.2 C24.2 C23.1 ; C26.2 25.15,25.51 25.16,25.53 U10.3
  Inner1 w0.201: v2(38.95,24.63) 37.95,25.63 v2(27.42,25.63)
  Inner2 w0.15: v2(39.76,17.89) 39.75,17.91 36.83,17.91 v1(36.83,20.7)
  Inner2 w0.201: v2(35.2,6.73) 35.2,12.76 39.76,17.32 v2(39.76,17.89)
  Bottom Layer w0.201: 34.78,1.16 34.78,2.14 34.29,2.14 33.78,2.65 33.78,5.31 v2(35.2,6.73) ; v2(38.95,24.63) 39.76,23.82 v2(39.76,17.89)
3V3: length 193.1
  Top Layer w0.15: U1.30 36.38,18.39 36.21,18.56 v1(36.21,19.17)
  Top Layer w0.28: 36.47,44.96 U3.11 ; 36.47,44.96 34.42,44.96 33.46,45.91 33.46,46.89 33.28,47.07 31.97,47.07 31.94,47.04 31.94,46.35 R3.2 ; 36.47,44.96 36.47,44.06 38.81,41.72 U5.A2 ; v2(89.25,22.86) 88.46,22.86 88.46,20.57 87.77,20.57 87.77,19.9 85.63,17.75 85.63,15.69 88.63,15.69 88.63,16.72 ; v2(86.87,29.35) 79.82,29.35 79.63,29.55 R12.2 ; 20.36,16.32 15.29,16.32 U16.5 ; 20.36,16.32 20.37,16.31 U17.5 ; 20.36,16.32 20.36,16.87 v2(21.48,17.98) C32.2 C30.2 C31.2 ; v2(11.93,45.28) 11.88,45.23 10.96,45.23 10.44,45.75 10.44,46.06 ; v2(21.64,46.53) 21.75,46.42 28.8,46.42 28.87,46.35 R3.2 ; 10.44,40.09 10.44,39.33 11.11,38.67 v2(12.08,38.67) ; R3.2 R2.2
  Inner1 w0.28: v2(21.64,46.53) 13.18,46.53 v2(11.93,45.28) ; v2(21.48,17.98) 21.77,18.27 v2(21.77,19.3) 21.89,19.17 v1(36.21,19.17) 36.72,19.68 39.22,19.68 41.15,21.61 47.71,21.61 48.02,21.92 52.74,21.92 53.05,21.61 67.94,21.61 68.81,22.48 81.63,22.48 81.69,22.54 82.14,22.54 82.2,22.48 88.86,22.48 v2(89.25,22.86)
  Bottom Layer w0.28: v2(86.87,29.35) 86.87,25.24 v2(89.25,22.86) ; v2(12.08,38.67) 12.08,45.13 v2(11.93,45.28) ; v2(21.64,46.53) 21.64,19.43 v2(21.77,19.3)
3V3A: length 19.7
  Top Layer w0.28: U10.21 25.66,34.58 ; 25.66,34.58 27.66,34.58 ; 25.66,34.58 24.43,34.58 24.16,34.3 U10.24 ; 27.66,34.58 27.66,35.93 27.81,36.08 27.81,36.76 22.51,36.76 22.5,36.77 19.29,36.77 19.28,36.76 16.26,36.76 ; 27.66,34.58 U10.17 U10.18
5V: length 149.6
  Top Layer w0.399: v2(80.77,21.62) 82.3,21.62 82.68,22 ; 48.13,41.28 48.13,41.97 48.82,41.97 48.96,42.11 55.61,42.11 56.18,41.54 57.61,41.54 57.68,41.47 v2(57.72,41.47) ; 4.45,16.93 4.45,20.04 4.42,20.07 ; 4.45,16.93 6.94,16.93 7.37,16.5 C39.2 C35.2 10.77,15.81 10.9,15.68 U16.1 13.53,15.68 14.22,15 16,15 ; 4.45,16.93 D3.1 ; R36.1 17.53,12.4 17.48,12.46 U17.3 16.69,13.78 16,14.47 ; 16,14.47 14.42,14.47 13.73,13.78 U16.3 ; 16,14.47 16,15 ; v2(18.41,15.59) 18.36,15.59 18.26,15.68 U17.1 16.69,15.68 16,15
  Inner1 w0.399: v2(57.72,41.47) 80.33,41.47 v2(82.77,39.03) ; v2(80.77,21.62) 73.23,21.62 73.1,21.75 72.61,21.75 71.76,20.9 68.72,20.9 63.02,15.2 18.79,15.2 v2(18.41,15.59)
  Bottom Layer w0.399: v2(82.77,39.03) 82.77,23.62 v2(80.77,21.62)
+3.3V: length 7.1
  Top Layer w0.28: 41.78,6.16 41.78,5.47 42.01,5.24 48.06,5.24
+3V3: length 29.5
  Top Layer w0.28: 66.17,46.87 66.17,47.19 64.88,47.19 64.61,46.92 63.15,46.92 ; 63.15,46.92 61.6,46.92 61.6,46.24 61.18,46.24 60.22,45.28 58.58,45.28 58.58,46.1 57.76,46.92 56.18,46.92 55.55,46.29 54.86,46.29 54.86,45.6 51.53,45.6 51.33,45.4 Q1.1 ; 63.15,46.92 v2(62.42,47.65) ; 69.49,51.55 69.44,51.6 v2(67.6,51.6)
  Bottom Layer w0.28: v2(67.6,51.6) 65.62,51.6 62.42,48.4 v2(62.42,47.65)
GND: length 632
  Top Layer w0.02: 40.76,38.8 40.76,38.8 40.76,41.66 40.71,41.72 40.57,41.72
  Top Layer w0.07: 11.18,47.75 11.18,48.45 15.68,48.45 U1#2.34
  Top Layer w0.099: 85.11,4.9 85.11,5.83 85.5,5.83 85.78,5.55 ; 41.78,6.93 41.79,6.93 53.77,6.93 54.55,6.14 SW3.3 63.32,6.14 U22.7 ; 41.78,6.93 C58.1 ; 41.78,6.93 41.78,6.88 41.1,6.88 40.09,5.87 30.29,5.87 ; 15.46,38.17 C10.2 C11.1 19.28,38.17 19.28,38.17 21.63,38.17 21.64,38.17 C13.2 C14.2 C15.1 33.05,38.17 33.56,37.66 C16.1 35.02,37.66 35.2,37.83 37.87,37.83 ; 15.46,38.17 11.06,38.17 9.05,40.18 9.05,40.66 9.68,41.3 11.06,41.3 ; 15.46,38.17 15.46,34.11 15.75,33.83 15.75,33.14 17.65,33.14 ; 42.93,36.38 42.93,37.07 43.61,37.07 43.84,37.29 43.84,38.79 ; 33.59,23.43 C38.1 33.59,20.77 ; 33.59,23.43 C28.1 C29.1 C22.1 C21.1 ; 33.59,23.43 C27.1 C26.1 C25.1 C24.1 v2(19.12,23.43) C23.2 ; 85.02,15.31 77.66,15.31 77.38,15.58 77.38,16.42 77.57,16.6 ; 85.02,15.31 85.02,19.22 86.37,20.57 87.06,20.57 87.06,22.86 ; 85.02,15.31 85.02,12.77 ; 71.2,27.52 71.2,27.57 ; 71.2,27.57 67.56,27.57 ; 71.2,27.57 71.27,27.65 72.19,27.65 72.3,27.53 72.56,27.27 ; v2(39.61,13.39) 39.78,13.39 40.03,13.14 C45.1 42.09,13.14 42.13,13.1 45.63,13.1 45.65,13.08 C48.1 ; v2(30.99,13.81) 30.99,13.02 32.84,13.02 32.91,12.95 C43.1 C44.1 32.91,15.24 32.65,15.49 ; 85.78,5.55 87.54,7.32 87.54,7.87 ; 85.78,5.55 86.31,5.02 86.31,4.92 ; 71.18,17.35 71.18,16.6 72.5,16.6 72.73,16.83 75.08,16.83 75.67,17.42 76.77,17.42 ; 71.18,17.35 70.61,17.35 70.45,17.52 ; 71.18,17.35 71.37,17.35 71.55,17.54 71.67,17.65 71.67,18.51 MIC5.5 71.3,18.88 70.69,18.88 MIC5.5 ; 85.02,12.77 87.63,12.77 ; 85.02,12.77 82.14,12.77 81.55,12.17 D4.1 D7.1 D6.1 81.55,7.39 81.31,7.15 J1.6 ; 87.63,12.77 87.63,11.22 ; 87.63,12.77 U20.11 ; 32.65,15.49 32.65,17.14 32.91,17.4 C36.1 C37.1 33.59,20.77 ; 32.65,15.49 R32.1 29.53,15.49 29.53,16.18 29.49,16.23 24.9,16.23 24.89,16.21 ; U1#2.9 49.53,51.82 52.07,51.82 U1#2.6 54.49,51.7 63.88,51.7 ; 7.14,3.3 3.95,3.3 2.54,1.89 2.54,1.58 ; 7.14,3.3 7.14,4.26 ; 7.14,3.3 7.75,3.3 9.14,1.91 USB1.6 16.36,1.58 U14.19 U14.17 U14.15 U14.13 ; 43.84,38.79 43.97,38.92 45.47,38.92 ; 43.84,38.79 38.83,38.79 37.87,37.83 ; 75.59,46.54 78.39,46.54 ; v2(86.05,46.63) 79.22,46.63 79.12,46.54 78.39,46.54 ; 33.59,20.77 C31.1 C30.1 C32.1 ; 45.47,38.92 45.47,41.28 46.21,41.28 v2(46.6,40.89) ; 45.47,38.92 48.13,36.26 54.76,36.26 57.53,33.48 U9.4 61.39,29.4 61.39,27.87 ; 10.44,41.69 11.14,41.69 ; 11.14,41.69 11.14,41.37 11.06,41.3 ; 11.14,41.69 11.18,41.73 11.18,43.42 v2(11.24,43.49) ; MIC6.4 77.57,16.6 ; 77.57,16.6 78.02,17.05 78.02,17.78 ; 71.95,26.31 71.95,25.49 MIC4.4 ; 71.95,26.31 72.2,26.31 72.32,26.43 72.56,26.67 72.56,27.27 ; 71.95,26.31 71.31,26.31 71.21,26.41 ; 30.29,5.87 30.29,6.6 ; 30.29,5.87 29.9,5.87 v2(29.78,5.75) ; 67.56,27.57 MIC3.5 67.26,27.87 66.6,27.87 66.37,27.64 66.36,27.66 62.27,27.66 ; 67.56,27.57 67.56,26.63 MIC3.5 67.38,26.44 67.12,26.44 ; C40.1 22.45,15.49 ; 22.45,15.49 22.11,15.49 21.35,14.73 U17.2 ; 22.45,15.49 23.19,16.23 24.87,16.23 24.89,16.21 ; 5.96,9.68 5.96,11.18 6.65,11.18 6.65,13.01 7.37,13.73 C39.1 C35.1 10.77,14.41 11.09,14.73 U16.2 ; 5.96,9.68 9.12,9.68 9.78,9.02 D5.2 ; 5.96,9.68 5.91,9.62 5.91,8.16 v2(8.05,8.16) ; 61.91,26.46 61.91,25.62 62.57,25.62 ; 61.91,26.46 61.25,26.46 ; 61.91,26.46 62.19,26.46 62.28,26.55 62.36,26.63 62.36,27.57 62.27,27.66 ; 54.32,26.79 54.49,26.62 55.05,26.62 ; U1#2.20 37.93,48.18 37.93,47.74 ; 63.88,51.7 64.14,51.96 66.17,51.96 C1.2 66.9,52.64 67.07,52.82 U6.1 ; 63.88,51.7 63.88,48.33 63.15,48.33 63.13,48.31 v2(63.04,48.31) 62.34,48.31 62.33,48.33 61.6,48.33 ; 72.56,27.27 73.81,28.53 SW2.1 ; 11.06,41.3 11.14,41.3 11.14,40.89 10.44,40.89 ; 78.02,17.78 78.02,18.38 77.76,18.64 77.52,18.88 76.91,18.88 76.66,18.63 ; 78.02,17.78 77.78,17.54 77.67,17.42 76.77,17.42 ; 54.3,27.9 54.56,28.15 55.17,28.15 55.41,27.91 55.54,27.78 55.54,26.92 55.43,26.81 55.24,26.62 55.05,26.62 ; 67.12,26.44 66.48,26.44 66.38,26.54 ; 67.12,26.44 67.12,25.62 67.78,25.62 ; 61.18,26.54 61.25,26.46 ; 61.25,26.46 59.87,26.46 59.5,26.1 56.6,26.1 56.38,25.87 55.05,25.87 55.05,26.62 ; v2(8.05,6.31) 6.89,6.31 6.59,6.6 5.91,6.6 ; X1.2 38.37,37.3 38.37,37.83 37.87,37.83 ; U1#2.14 43.18,49.83 44.58,48.43 R5.2 R4.2 37.93,47.74 ; U3.6 37.21,47.43 37.61,47.43 37.93,47.74 ; v2(61.26,45.24) 61.43,45.08 62.56,45.08 SW1.1 ; U14.3 U14.5 U14.7 26.78,1.16 ; J1.8 87.24,2.29 J1.10 81.78,2.29 81.7,2.22 80.31,2.22 79.6,2.92 71.63,2.92 U22.4 ; 76.77,17.42 MIC6.5 ; 78.39,46.54 78.39,45.5 ; 62.27,27.66 62.06,27.87 61.39,27.87 ; 24.89,16.21 24.89,14.88 23.54,13.53 22.94,13.53 22.23,12.82 22.23,12.06 U19.2 ; 78.39,45.5 78.09,45.5 77.72,45.14 U6.39 U6.39 ; 78.39,45.5 U6.39 U6.39 U6.39 U6.39 ; 61.39,27.87 61.16,27.64 ; 19.44,28.19 18.75,28.19 18.73,28.21 v2(17.46,28.21) 16.13,26.88 5.22,26.88 3.42,28.68 2.03,28.68
  Inner1 w0.099: v2(86.05,46.63) 64.71,46.63 v2(63.04,48.31) ; v2(30.99,13.81) 39.19,13.81 v2(39.61,13.39)
  Bottom Layer w0.099: v2(8.05,8.16) v2(8.05,6.31) 8.05,2.67 USB1.6 ; U14.13 23.78,2.16 25.78,2.16 26.78,1.16 ; 17.46,50.55 U1#2.34 18.89,51.66 21.75,51.66 U1#2.30 ; 17.46,50.55 17.46,50.73 16.37,51.82 11.59,51.82 11.43,51.66 ; 17.46,50.55 v2(17.46,28.21) 17.46,25.09 v2(19.12,23.43) ; 86.31,4.92 86.31,3.22 J1.8 ; 46.82,51.66 46.82,44.26 46.54,43.99 46.54,40.95 v2(46.6,40.89) ; 46.82,51.66 44.29,51.66 U1#2.14 ; 46.82,51.66 46.83,51.66 U1#2.9 ; v2(61.26,45.24) 63.04,47.01 v2(63.04,48.31) ; 11.43,51.66 11.41,51.64 10.98,51.64 10.72,51.9 9.6,51.9 9.58,51.88 9.26,51.88 8.47,51.09 8.47,45.9 10.88,43.49 v2(11.24,43.49) ; 11.43,51.66 11.43,51.82 U1#2.39 ; v2(86.05,46.63) 86.15,46.74 U43.3 U43.2 ; U22.4 69.09,2.92 66.55,2.92 U22.7 U22.10 ; 80.31,2.22 81.31,3.22 J1.6 ; v2(30.99,13.81) 30.99,6.95 v2(29.78,5.75) 29.78,2.16 U14.5
  vias: v1(0.65,26.08) v1(0.65,25.08) v1(0.7,24.15) v1(0.7,23.33) v1(1.04,44.2) v1(1.05,43.22) v1(1.01,40.27) v1(1.03,39.25) v1(1.09,42.27) v1(1.09,41.3) v1(1.52,53.82) v1(1.51,52.88) v1(1.5,51.83) v1(1.51,50.77) v1(1.54,49.58) v1(1.53,48.64) v1(1.52,47.59) v1(1.52,46.53) v1(1.55,45.51) v1(1.66,26.09) v1(1.67,25.09) v1(1.71,24.16) v1(1.72,23.34) v1(1.97,44.2) v1(1.99,43.21) v1(2.02,42.28) v1(2.04,41.29) v1(2.04,40.3) v1(2.05,39.26) v1(2.5,53.82) v1(2.5,52.9) v1(2.53,51.85) v1(2.54,50.78) v1(2.51,49.58) v1(2.52,48.66) v1(2.55,47.61) v1(2.56,46.54) v1(2.57,45.52) v1(2.73,26.1) v1(2.74,25.1) v1(2.78,24.17) v1(2.79,23.35) v1(3.02,44.24) v1(3.04,43.21) v1(3.07,42.31) v1(3.08,41.28) v1(3.1,40.3) v1(3.11,39.27) v1(3.78,26.13) v1(3.88,53.88) v1(3.87,52.94) v1(3.86,51.89) v1(3.86,50.83) v1(3.87,47.65) v1(3.87,46.59) v1(3.79,25.13) v1(3.83,24.21) v1(3.84,23.38) v1(3.89,49.64) v1(3.88,48.7) v1(3.91,45.57) v1(4.09,44.25) v1(4.1,43.21) v1(4.13,42.32) v1(4.15,41.28) v1(4.15,40.29) v1(4.16,39.3) v1(4.85,53.88) v1(4.86,52.96) v1(4.87,49.64) v1(4.87,48.72) v1(4.89,51.91) v1(4.9,50.84) v1(4.9,47.67) v1(4.91,46.6) v1(4.92,45.59) v1(4.96,26.11) v1(4.97,25.11) v1(5.01,24.18) v1(5.02,23.36) v1(5.28,44.22) v1(5.29,43.24) v1(5.33,42.29) v1(5.34,41.31) v1(5.34,40.31) v1(5.35,39.28) v1(5.9,26.1) v1(5.91,25.11) v1(5.95,24.18) v1(5.96,23.36) v1(6.21,44.22) v1(6.23,43.23) v1(6.26,42.29) v1(6.28,41.3) v1(6.28,40.31) v1(6.32,53.88) v1(6.31,52.94) v1(6.31,51.89) v1(6.31,50.83) v1(6.34,49.64) v1(6.33,48.7) v1(6.32,47.65) v1(6.32,46.59) v1(6.35,45.57) v1(6.29,39.28) v1(6.97,26.11) v1(6.98,25.12) v1(7.02,24.19) v1(7.03,23.37) v1(7.26,44.25) v1(7.28,43.22) v1(7.22,12.96) v1(7.23,11.92) v1(7.23,11.03) v1(7.21,10.12) v1(7.3,53.88) v1(7.3,52.96) v1(7.33,51.91) v1(7.34,50.84) v1(7.31,49.64) v1(7.32,48.72) v1(7.35,47.67) v1(7.36,46.6) v1(7.37,45.59) v1(7.31,42.32) v1(7.32,41.3) v1(7.34,40.31) v1(7.35,39.29) v1(8.02,26.15) v1(8.03,25.15) v1(8.07,24.22) v1(8.08,23.4) v1(8.33,44.26) v1(8.34,43.22) v1(8.37,42.34) v1(8.28,12.96) v1(8.3,11.93) v1(8.28,11.05) v1(8.29,10.12) v1(8.39,41.3) v1(8.39,40.31) v1(8.4,39.32) v1(9.04,26.11) v1(9.05,25.11) v1(9.09,24.18) v1(9.1,23.36) v1(9.34,44.27) v1(9.36,43.25) v1(9.33,12.95) v1(9.35,11.97) v1(9.34,11.04) v1(9.34,10.12) v1(10.06,26.12) v1(10.06,25.12) v1(10.11,24.19) v1(10.11,23.37) v1(10.27,12.95) v1(10.28,11.97) v1(10.27,10.12) v1(10.28,10.99) v1(10.59,21.27) v1(11.12,26.13) v1(11.13,25.13) v1(11.17,24.2) v1(11.18,23.38) v1(11.64,21.3) v1(11.78,3.89) v1(11.78,2.98) v1(11.79,4.85) v1(11.79,2.08) v1(11.8,1.02) v1(12.17,26.16) v1(12.18,25.17) v1(12.22,24.24) v1(12.23,23.42) v1(12.83,21.28) v1(12.84,10.08) v1(12.86,9.06) v1(12.88,8.17) v1(12.87,7.28) v1(12.87,6.5) v1(12.88,4.85) v1(12.87,3.91) v1(12.87,2.98) v1(12.87,2.07) v1(12.89,5.7) v1(12.88,1.02) v1(13.36,26.14) v1(13.37,25.14) v1(13.41,24.21) v1(13.41,23.39) v1(13.77,21.27) v1(13.74,19.15) v1(13.86,10.11) v1(13.87,9.07) v1(13.86,8.18) v1(13.85,7.27) v1(13.86,6.53) v1(13.91,5.66) v1(13.92,4.84) v1(13.94,3.93) v1(13.95,2.97) v1(13.93,2.07) v1(13.93,1.01) v1(14.3,26.13) v1(14.3,25.14) v1(14.34,24.21) v1(14.35,23.39) v1(14.83,21.29) v1(14.79,19.19) v1(14.86,4.85) v1(14.86,3.92) v1(14.86,2.97) v1(14.86,2.06) v1(14.86,1.02) v1(14.92,10.11) v1(14.94,9.08) v1(14.92,8.2) v1(14.93,7.27) v1(14.95,6.53) v1(14.96,5.66) v1(15.37,26.15) v1(15.37,25.15) v1(15.41,24.22) v1(15.42,23.4) v1(15.88,21.32) v1(15.97,19.16) v1(15.97,10.1) v1(15.98,7.26) v1(15.89,5.66) v1(15.99,9.11) v1(15.98,8.19) v1(15.99,6.52) v1(16.03,4.87) v1(16.42,26.18) v1(16.42,25.18) v1(16.46,24.25) v1(16.47,23.43) v1(16.83,21.27) v1(16.91,19.16) v1(16.91,10.09) v1(16.91,9.12) v1(16.92,8.19) v1(16.91,7.27) v1(16.93,6.53) v1(17.07,5.68) v1(17.12,4.87) v1(17.88,21.3) v1(17.98,19.17) v1(18.1,10.12) v1(18.11,9.09) v1(18.1,8.19) v1(18.09,7.29) v1(18.1,6.55) v1(18.15,5.68) v1(18.16,4.86) v1(19.06,21.28) v1(19.03,19.2) v1(19.16,10.12) v1(19.18,9.1) v1(19.16,8.21) v1(19.17,7.29) v1(19.1,4.87) v1(19.19,6.55) v1(19.2,5.67) v1(20,21.27) v1(20.13,5.68) v1(20.21,10.12) v1(20.23,9.13) v1(20.22,8.2) v1(20.22,7.28) v1(20.23,6.54) v1(21.07,21.29) v1(21.15,10.11) v1(21.15,9.13) v1(21.16,8.15) v1(21.15,7.29) v1(21.17,6.55) v1(29.64,25.16) v1(29.69,24.05) v1(29.69,21.64) v1(29.99,18.19) v1(30.98,34.59) v1(31.04,33.25) v1(31.79,25.18) v1(31.8,24.11) v1(31.8,21.65) v1(31.93,18.19) v1(32.08,31.43) v1(32.08,29.37) v1(32.08,27.9) v1(32.14,26.35) v1(32.26,38.63) v1(32.2,37.42) v1(32.24,36.16) v1(33.37,33.04) v1(33.39,34.51) v1(41.15,3.63) v1(41.17,2.61) v1(41.15,1.85) v1(41.17,0.83) v1(42.17,3.66) v1(42.17,1.88) v1(42.18,2.62) v1(42.18,0.84) v1(43.23,3.66) v1(43.25,2.63) v1(43.23,1.88) v1(43.25,0.85) v1(44.28,1.88) v1(44.28,3.66) v1(44.3,2.67) v1(44.3,0.89) v1(44.7,36.3) v1(45.47,3.67) v1(45.47,1.89) v1(45.49,2.64) v1(45.48,0.86) v1(46.41,3.68) v1(46.42,2.64) v1(46.41,1.9) v1(46.42,0.86) v1(47.1,36.29) v1(47.47,3.68) v1(47.47,1.9) v1(47.49,2.65) v1(47.49,0.87) v1(48.52,3.67) v1(48.54,2.68) v1(48.52,1.89) v1(48.54,0.9) v1(49.42,3.61) v1(49.44,2.59) v1(49.4,1.77) v1(49.42,0.75) v1(50.45,3.64) v1(50.46,2.6) v1(50.42,1.8) v1(50.44,0.76) v1(51.51,3.64) v1(51.52,2.61) v1(51.49,1.8) v1(51.5,0.77) v1(52.55,3.63) v1(52.57,2.64) v1(52.53,1.8) v1(52.55,0.81) v1(53.74,3.65) v1(53.76,2.62) v1(53.72,1.81) v1(53.74,0.78) v1(54.66,1.82) v1(54.68,0.78) v1(54.69,3.65) v1(54.7,2.62) v1(55.75,3.66) v1(55.76,2.63) v1(55.73,1.82) v1(55.74,0.79) v1(56.77,1.81) v1(56.8,3.65) v1(56.81,2.66) v1(56.79,0.82) v1(60.25,38.76) v1(60.22,37.15) v1(60.22,35.62) v1(60.22,34.06) v1(60.21,32.57) v1(61.44,38.77) v1(61.42,37.15) v1(61.4,35.63) v1(61.4,34.06) v1(61.4,32.58) v1(62.58,34.05) v1(62.57,32.56) v1(62.61,38.77) v1(62.6,37.13) v1(62.6,35.62) v1(91.6,8.47) v1(91.59,7.42) v1(91.59,6.36) v1(91.6,5.42) v1(91.61,4.23) v1(91.61,3.18) v1(91.61,2.12) v1(91.64,1.1) v1(92.59,8.49) v1(92.62,7.44) v1(92.63,6.37) v1(92.63,5.43) v1(92.6,4.25) v1(92.63,3.2) v1(92.64,2.13) v1(92.66,1.12) v1(93.84,17.5) v1(93.83,16.45) v1(93.83,15.39) v1(93.84,14.45) v1(93.86,13.26) v1(93.85,12.21) v1(93.85,11.15) v1(93.88,10.12) v1(93.97,8.52) v1(93.96,7.47) v1(93.96,6.41) v1(93.97,5.47) v1(93.98,3.23) v1(93.98,2.17) v1(93.98,4.28) v1(94.01,1.15) v1(94.83,17.52) v1(94.86,16.47) v1(94.87,15.4) v1(94.87,14.46) v1(94.84,13.28) v1(94.88,12.23) v1(94.89,11.16) v1(94.9,10.14) v1(94.96,8.54) v1(94.97,4.3) v1(94.99,7.49) v1(95,6.42) v1(95,5.48) v1(95,3.25) v1(95.01,2.18) v1(95.03,1.16)
VDD: length 66.7
  Top Layer w0.1: 46.52,19.79 46.7,19.61 47.44,19.61 47.47,19.58 ; 41.66,22.87 41.61,22.92 41.61,23.6 41.64,23.64 42.43,23.64 ; 45.67,23.75 46.35,23.75 46.47,23.62 46.47,22.8
  Top Layer w0.15: 41.52,19.96 41.52,18.68 41.53,18.67 42.93,18.67 ; 41.52,19.96 U1.62 ; 41.52,19.96 41.15,19.59 U1.27 39.08,19.59 38.86,19.81 35.25,19.81 C37.2 ; U1.62 41.12,21.59 U1.22 ; U1.62 41.52,22.3 41.02,22.79 U1.19 ; 45.22,18.69 45.21,18.69 U1.63 ; 45.22,18.69 46.41,18.69 46.52,18.8 U1.64 46.52,22.32 46.99,22.79 U1.57 ; 45.22,18.69 45.62,18.29 U1.42 ; 45.22,18.69 44.02,18.69 U1.63 ; U1.4 45.62,24 45.48,23.87 44.02,23.87 ; U1.63 42.95,18.69 42.93,18.67 ; U1.63 43.99,18.67 42.93,18.67 ; U1.34 42.42,18.16 42.93,18.67
  Top Layer w0.17: U1.12 42.42,24.26 42.8,23.88 44.02,23.88
  Top Layer w0.299: 34.65,12.95 34.65,14.16 34.99,14.51 C44.2 C36.2 C37.2 C38.2 C28.2 C29.2 C22.2 C21.2 ; 34.65,12.95 C43.2 ; 34.65,12.95 34.31,12.95 34.31,12.27 33.6,11.56 26.95,11.56 26.9,11.62 26.16,11.62 26.16,9.58 26.02,9.44 26.02,8.25
VDDIO: length 202.9
  Top Layer w0.15: v2(44.76,26.57) 44.76,24.75 U1.6 ; U1.8 44.02,25.32 43.56,25.78 v1(43.56,26.59)
  Top Layer w0.17: v2(60.09,25.65) 60.09,25.4 59.03,24.33 58.69,24.33 58.67,24.31 57.66,24.31 57.64,24.33 55.36,24.33 54.61,23.58 54.61,22.61 54.1,22.1 52.52,22.1 51.98,21.57 51.98,20.96 51.82,20.79 U1.52
  Top Layer w0.299: R39.2 61.81,11.3 ; 61.81,11.3 62.15,11.3 62.21,11.24 C49.2 C50.2 C51.2 70.99,11.24 ; 61.81,11.3 59.31,13.79 47.06,13.79 47.06,14.13 ; v2(58.76,39.84) 58.27,40.33 55.05,40.33 53.72,39.01 53.72,38.62 49.69,38.62 49.4,38.34 C18.1 ; 24.78,1.16 25.77,2.14 v2(40.1,2.14) ; 70.99,11.24 70.99,15.32 ; 70.99,11.24 C52.2 v2(73.34,11.24) C53.2 C54.2 ; 37.95,45.45 38.64,45.45 38.64,45.27 v2(38.75,45.16) ; v2(65.32,25.72) 65.42,25.62 66.55,25.62 66.77,25.39 66.77,24.76 67.13,24.41 69.16,24.41 70.24,25.49 70.9,25.49 ; 70.99,15.32 70.99,16.22 70.61,16.6 MIC5.2 v2(68.6,16.6) ; 70.99,15.32 74.59,15.32 75.7,16.43 75.7,16.6 MIC6.2 ; 60.87,25.62 60.13,25.62 v2(60.09,25.65) ; 42.93,14.5 45.63,14.5 45.99,14.13 47.06,14.13 ; 42.93,14.5 42.13,14.5 42.08,14.54 v2(39.92,14.54) ; 42.93,14.5 43.12,14.69 43.12,15.12 44.02,16.02 U1.38 ; 47.06,14.13 C48.2
  Inner1 w0.299: v2(58.76,39.84) 53.09,39.84 47.77,45.16 v2(38.75,45.16) ; v2(65.32,25.72) 65.25,25.65 v2(60.09,25.65) 45.68,25.65 v2(44.76,26.57) 44.69,26.57 44.69,27.56 43.56,27.56 v1(43.56,26.59)
  Bottom Layer w0.299: v2(65.32,25.72) 65.82,25.22 65.82,19.38 v2(68.6,16.6) ; v2(73.34,11.24) 72.9,10.8 U22.1 ; v2(58.76,39.84) 58.76,26.98 v2(60.09,25.65) ; v2(39.92,14.54) 40.1,14.37 v2(40.1,2.14)
VDDIO0: length 45.2
  Top Layer w0.299: 11.91,40.09 12.61,40.09 12.85,39.85 v2(18.48,39.85) ; U3.1 38.35,44.64 v2(39.09,44.64) 39.09,42.78 39.74,42.12 40.13,42.12 ; v2(21.07,45.02) 13.65,45.02 12.61,46.06 11.91,46.06
  Inner1 w0.299: v2(21.07,45.02) 38.21,45.02 38.58,44.64 v2(39.09,44.64)
  Bottom Layer w0.299: v2(21.07,45.02) 18.48,42.43 v2(18.48,39.85)
BOOT_SEL: length 16.2
  Top Layer w0.099: R17.1 47.75,31.92 v2(43.65,31.92) ; v2(43.65,40.91) 42.21,40.91 41.79,41.32 41.4,41.32
  Bottom Layer w0.099: v2(43.65,31.92) 43.65,31.93 v2(43.65,40.91)
BUTA: length 30
  Top Layer w0.201: R39.1 52.97,11.3 52.13,12.14 SW3.2 v2(49.95,12.14) ; v2(42.56,26.64) 42.82,26.39 U1.11
  Bottom Layer w0.201: v2(42.56,26.64) 42.56,22.27 49.95,14.88 v2(49.95,12.14)
D+: length 7.1
  Top Layer w0.099: J1.3 83.81,6.99 84.45,7.64 84.45,9.01 85.63,10.19 85.63,11.22
D-: length 12.4
  Top Layer w0.099: J1.2 83.16,6.95 83.64,7.44 83.64,8.69 83.05,9.29 D7.2 D4.2 83.05,12.17 83.13,12.25 86.63,12.25 86.63,11.22
DAC_RST: length 4.2
  Top Layer w0.15: v1(46.44,16.51) 46.42,16.53 U1.44 ; U1.40 44.82,16.62 v1(44.7,16.51)
  Inner1 w0.15: v1(44.7,16.51) v1(46.44,16.51)
DN: length 53.6
  Top Layer w0.099: 10.43,5.71 D5.6 ; 10.43,5.71 9.94,5.22 5.84,5.22 5.84,4.26 ; 10.43,5.71 10.96,6.23 v2(11.52,6.23)
  Top Layer w0.15: U1.28 40.5,19.18 38.74,19.18 v1(38.67,19.25)
  Inner1 w0.099: v2(11.97,20.21) 11.97,20.2 v2(38.59,20.2)
  Inner2 w0.15: v2(38.59,20.2) 38.36,20.2 37.72,19.56 37.72,18.8 37.83,18.69 38.11,18.69 v1(38.67,19.25)
  Bottom Layer w0.099: v2(11.52,6.23) 11.52,9 11.61,9.08 11.61,9.33 11.52,9.41 11.52,19.77 v2(11.97,20.21)
DP: length 53.1
  Top Layer w0.099: v2(5.19,5.35) 5.19,4.26 ; D5.1 10.43,9.02 11.12,9.02 v2(11.3,9.21)
  Top Layer w0.15: v2(39.08,11.15) 38.84,11.4 38.84,16.54 37.59,17.78 v1(36.32,17.78) ; U1.29 38.99,18.79 v1(38.99,18.8)
  Inner1 w0.099: v2(5.19,5.35) 7.07,7.23 9.33,7.23 v2(11.3,9.21) 11.3,9.78 13.1,11.58 38.65,11.58 v2(39.08,11.15)
  Inner1 w0.15: v1(38.99,18.8) 36.96,18.8 36.32,18.16 v1(36.32,17.78)
DTR: length 44.4
  Top Layer w0.201: U11.1 64.52,32.59 66.06,31.05 80.33,31.05 81.02,30.36 81.02,30.04 U13.2 v2(86.36,30.04) ; 88.63,11.22 88.63,12.25 88.92,12.25 v2(89.42,12.76)
  Bottom Layer w0.201: v2(86.36,30.04) 86.36,15.81 v2(89.42,12.76)
I2S_BCLK: length 51.7
  Top Layer w0.099: 11.91,46.46 13.13,46.46 13.86,45.74 v2(26.73,45.74)
  Top Layer w0.14: v2(42.07,27.08) 42.02,27.03 U1.13
  Inner1 w0.099: v2(26.73,26.98) 41.97,26.98 v2(42.07,27.08)
  Bottom Layer w0.099: v2(26.73,26.98) v2(26.73,45.74)
I2S_DATA0: length 0.4
  Top Layer w0.15: U1.10 U1.9
I2S_OE: length 3.8
  Top Layer w0.099: R4.1 41.02,46.23 41.02,45.56 40.98,45.52 40.98,43.59 41.04,43.53 41.04,43.25 40.99,43.2 40.98,42.53 U5.C4
INT_N: length 25.9
  Top Layer w0.02: 41.19,41.63 41.18,41.64 41.09,41.64 40.99,41.73 ; v1(42.55,39.88) 42.54,39.89 42.54,39.92 42.41,40.05 42.15,40.05 41.19,41.01 41.19,41.63
  Top Layer w0.15: v1(49.91,22.61) 49.3,21.99 47.52,21.99
  Inner2 w0.17: v1(42.55,39.88) 50.17,32.26 50.17,23.49 49.91,23.24 v1(49.91,22.61)
IO0: length 14
  Top Layer w0.201: 86.15,31.93 SW2.2 ; 86.15,31.93 85.78,31.93 84.84,30.99 81.29,30.99 80.53,31.74 R12.1 ; 86.15,31.93 86.15,36.31 87.48,36.31
MCLK: length 60.4
  Top Layer w0.14: U1.14 41.62,26.24 v2(41.49,26.36)
  Top Layer w0.15: U1.41 45.22,15.75 v1(45.21,15.75)
  Top Layer w0.201: 11.91,40.49 17.25,40.49 v2(17.95,41.19)
  Inner1 w0.201: v2(17.95,41.19) 18.39,40.75 v2(37.82,40.75)
  Bottom Layer w0.201: v2(37.82,40.75) 37.82,30.04 v2(41.49,26.36) 41.49,15.75 41.64,15.61 41.84,15.61 41.98,15.75 v1(45.21,15.75)
MCLK_OE: length 40.7
  Top Layer w0.099: 41.4,42.12 42.14,42.12 v2(42.58,41.68) ; R5.1 v2(43.15,46.24) ; 11.18,40.01 11.18,39.31 v2(11.57,39.31)
  Inner1 w0.099: v2(42.58,41.68) 40.21,39.31 v2(11.57,39.31)
  Bottom Layer w0.099: v2(43.15,46.24) 43.15,42.24 v2(42.58,41.68)
MIC0_DATA: length 4.6
  Top Layer w0.201: R21.2 53.47,19.94 55.02,18.39 U18.2
MIC1_DATA: length 10.7
  Top Layer w0.201: 55.76,22.86 55.76,20.81 57.53,19.05 57.53,18.21 57.06,17.74 55.03,17.74 54.56,17.27 54.56,16.95 55.08,16.44 U18.5
MIC2_DATA: length 3
  Top Layer w0.201: 62.89,15.79 64.89,15.79 65.11,16 R33.2
MIC3_DATA: length 4.4
  Top Layer w0.201: 62.89,17.48 62.89,17.74 ; 62.89,17.48 65.91,17.48 65.91,18.17 ; 62.89,17.48 U18.13
MIC4_DATA: length 6.7
  Top Layer w0.201: 58.05,21.08 58.05,16.96 56.88,15.79 55.99,15.79
MIC5_DATA: length 14.7
  Top Layer w0.201: U18.10 v2(70.02,15.14) ; v2(70.02,21.5) 70.19,21.67 70.19,21.97 R25.2
  Bottom Layer w0.201: v2(70.02,15.14) v2(70.02,21.5)
MIC_CLK: length 49.5
  Top Layer w0.15: U1.43 45.97,17.65 v1(45.97,15.87)
  Top Layer w0.2: v1(50.93,21.34) 51.42,21.83 U15.2
  Inner1 w0.099: 46.32,15.85 61.44,15.85 61.44,18.4 v2(61.3,18.54)
  Inner1 w0.15: 46.32,15.85 46.3,15.87 v1(45.97,15.87)
  Inner2 w0.2: v1(45.97,15.87) 49.24,15.87 50.14,16.77 50.14,20.55 v1(50.93,21.34)
  Bottom Layer w0.099: U22.3 70.36,9.49 v2(61.3,18.54)
MIC_DATA0: length 30.4
  Top Layer w0.2: v2(49.22,18.39) U1.46
  Inner1 w0.201: v2(60.48,18.53) 49.35,18.53 v2(49.22,18.39)
  Bottom Layer w0.201: U22.5 67.82,11.13 60.48,18.47 v2(60.48,18.53)
MIC_DATA1: length 32.4
  Top Layer w0.13: v2(51.59,19.86) 51.56,19.84 51.39,19.84 51.26,19.71 48.74,19.71 48.46,19.99 47.52,19.99
  Top Layer w0.201: U22.6 66.55,2.92 v2(61.09,2.92)
  Bottom Layer w0.201: v2(51.59,19.86) 61.09,10.37 v2(61.09,2.92)
MIC_DATA2: length 32.1
  Top Layer w0.1: 47.54,19.21 50.62,19.21 v1(50.74,19.09)
  Inner2 w0.1: 65.38,1.57 64.8,1.57 63.32,3.05 62.16,3.05 61.34,2.23 61.34,1.39 61.08,1.13 60.49,1.13 50.76,10.86 50.76,19.11
MIC_DATA3: length 29
  Top Layer w0.13: v1(49.36,20.19) 49.36,20.36 49.33,20.39 U1.51
  Inner1 w0.201: v1(49.36,20.19) 49.62,20.45 56.87,20.45 v2(57.19,20.76)
  Bottom Layer w0.201: U22.9 62.74,15.21 v2(57.19,20.76)
PI_5V: length 76.3
  Top Layer w0.201: U1#2.2 U1#2.4
  Top Layer w0.3: D1.2 7.52,20.95 8.15,20.95 v2(9.11,21.91)
  Inner1 w0.3: v2(9.11,21.91) 9.16,21.91 9.84,22.6 18.69,22.6 18.76,22.53 19.47,22.53 19.54,22.6 48.77,22.6 48.82,22.65 v2(48.83,22.65)
  Bottom Layer w0.201: U1#2.4 55.88,29.7 v2(48.83,22.65)
PI_I2C_SCL: length 57.8
  Top Layer w0.099: U5.A4 40.13,42.91 40.07,42.97 40.07,46.56 40.45,46.94 49.32,46.94 49.69,47.3 Q1.2 51.33,47.3 51.48,47.45 52.7,47.45 ; 52.7,47.45 52.7,47.11 ; 52.7,47.45 52.7,47.8 54.58,49.67 v2(54.58,50.88) ; U6.36 86.15,50.28 86.15,50.77 v2(86.05,50.88)
  Inner1 w0.099: v2(54.58,50.88) v2(86.05,50.88)
  Bottom Layer w0.099: v2(54.58,50.88) 53.34,52.12 U1#2.5
PI_I2C_SDA: length 60.5
  Top Layer w0.02: 43.3,41.51 43.3,41.49 43.03,41.21 42.38,41.21 41.68,41.92 40.76,41.92 40.55,42.13
  Top Layer w0.099: 87.48,46.47 86.58,46.47 86.07,45.95 v2(84.42,45.95) ; v2(60.33,47.28) 60.22,47.18 58.58,47.18 58.42,47.34 55.81,47.34 55.58,47.11 54.86,47.11
  Top Layer w0.1: 54.86,48.53 54.86,47.16 54.88,47.15
  Inner1 w0.099: v2(60.33,47.28) 61.66,45.95 v2(84.42,45.95)
  Inner2 w0.1: 43.3,41.51 45.51,43.72 50.05,43.72 54.85,48.52 54.85,48.53
  Bottom Layer w0.099: v2(60.33,47.28) 60.08,47.28 57.15,50.21 57.15,51.82 U1#2.3
  vias: v1(43.32,41.52) v1(54.85,48.55)
PI_I2S_BCLK: length 40.2
  Top Layer w0.1: 10.45,46.47 9.43,46.47 9.3,46.34
  Inner2 w0.1: 9.4,46.31 11.31,48.22 34.13,48.22 34.34,48.43 34.34,48.83 34.44,48.93 45.56,48.93 45.72,49.08 45.72,50.38
  vias: v1(9.33,46.32)
PI_I2S_DIN: length 3.8
  Top Layer w0.099: 10.44,47.66 10.44,48.29 U1#2.38
PI_I2S_DOUT: length 4.2
  Top Layer w0.099: U1#2.40 9.74,50.13 9.74,47.26 10.44,47.26
